# EAGLE design AVR-Doper (EAGLE 4.16)
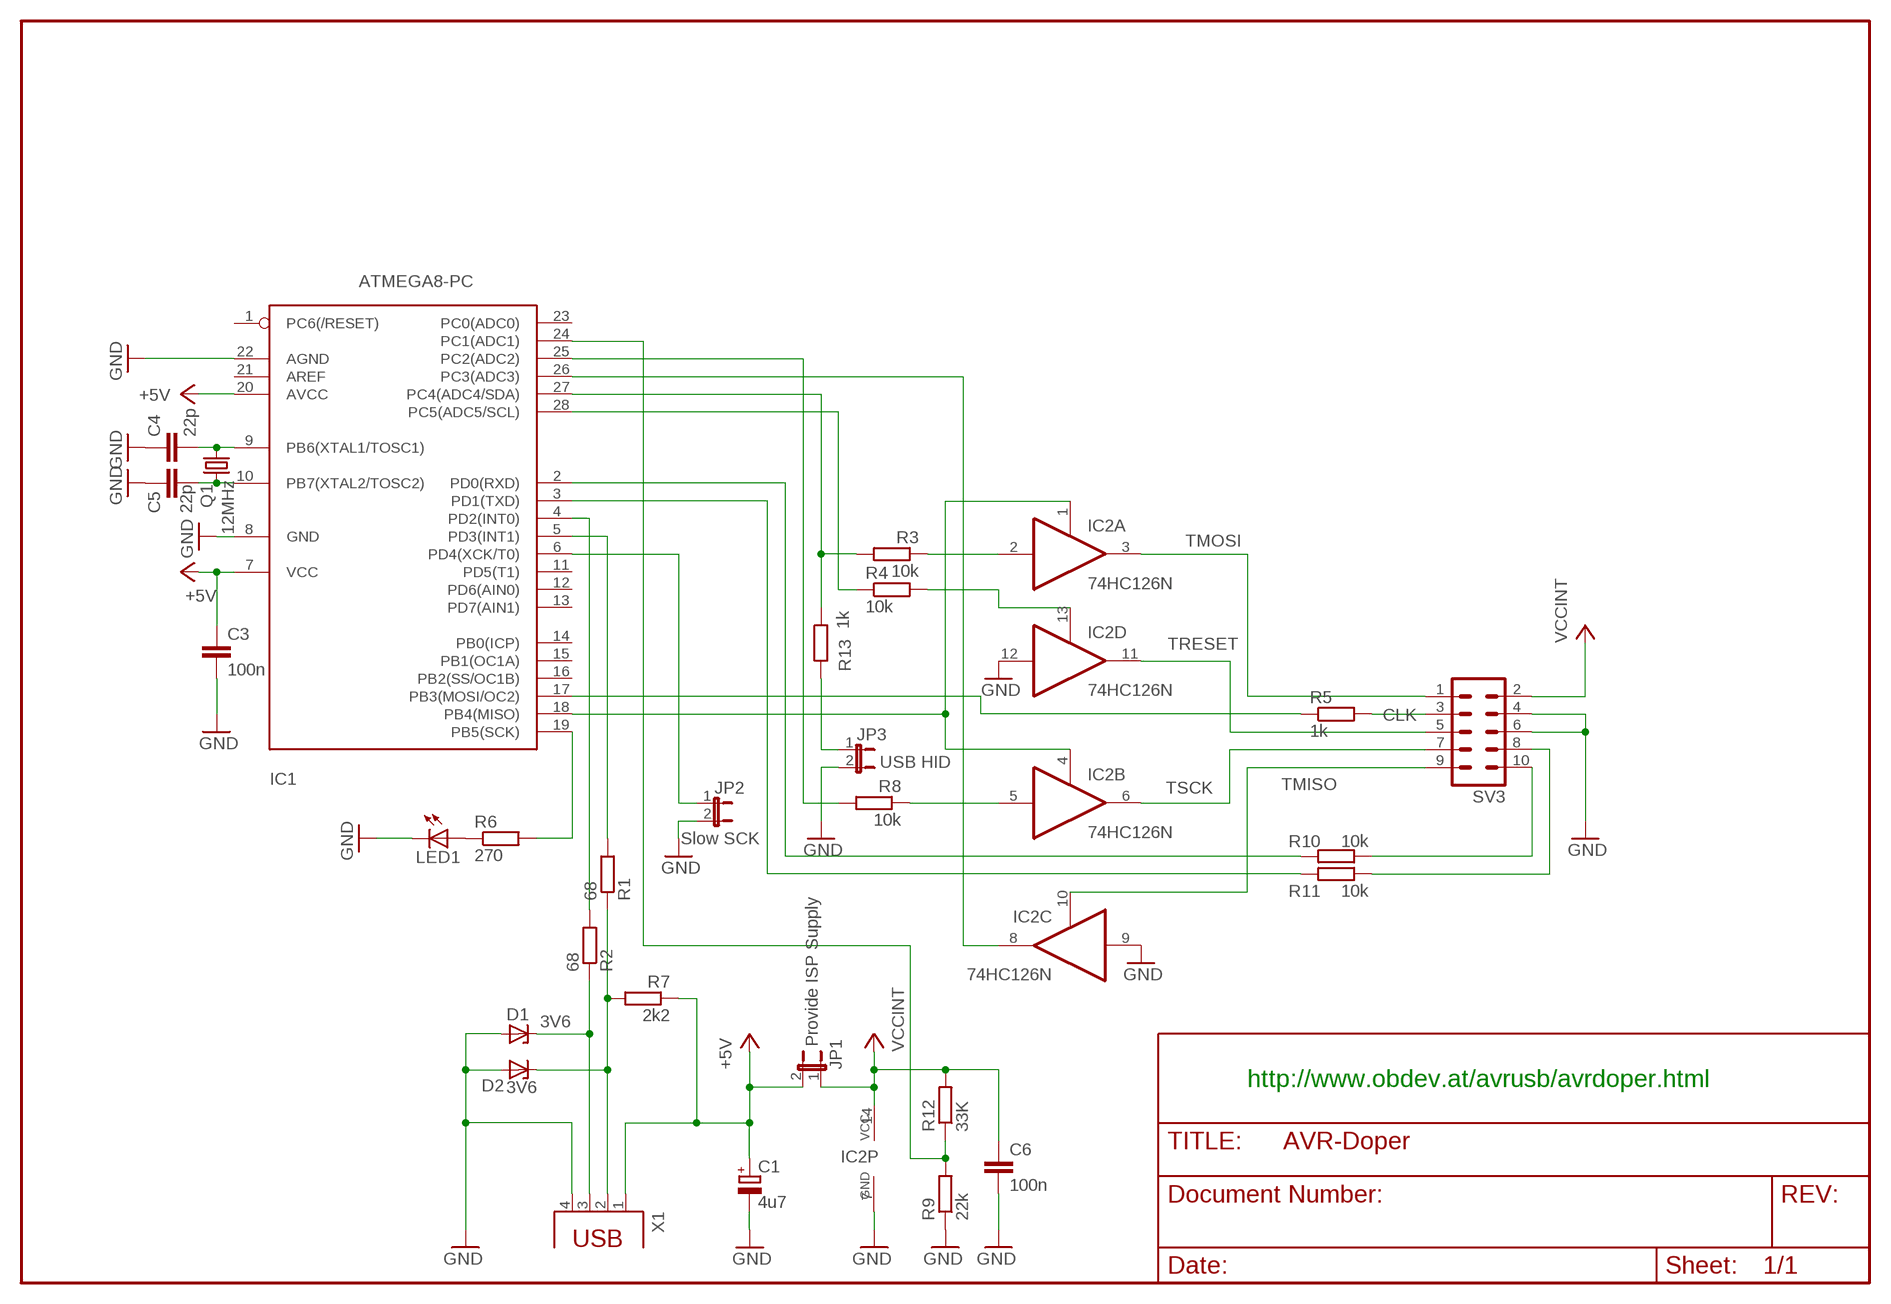
[diagram p0: schematic, sheet 1]

## Parts
C1  4u7  CPOL-EUE2.5-5  [E2,5-5]
C3  100n  C-EU025-024X044  [C025-024X044]
C4  22p  C-EU025-024X044  [C025-024X044]
C5  22p  C-EU025-024X044  [C025-024X044]
C6  100n  C-EU025-024X044  [C025-024X044]
D1  3V6  ZENER-DIODEDO34-7  [DO34Z7]
D2  3V6  ZENER-DIODEDO34-7  [DO34Z7]
IC1  ATMEGA8-PC  MEGA8-P  [DIL28-3]
IC2  74HC126N  [DIL14]
JP1  Provide ISP Supply  JP1E  [JP1]
JP2  Slow SCK  JP1E  [JP1]
JP3  USB HID  JP1E  [JP1]
LED1  LED3MM  [LED3MM]
Q1  12MHz  CRYTALHC49S  [HC49/S]
R1  68  R-EU_0207/10  [0207/10]
R2  68  R-EU_0207/10  [0207/10]
R3  10k  R-EU_0207/10  [0207/10]
R4  10k  R-EU_0207/15  [0207/15]
R5  1k  R-EU_0207/15  [0207/15]
R6  270  R-EU_0207/12  [0207/12]
R7  2k2  R-EU_0207/10  [0207/10]
R8  10k  R-EU_0207/10  [0207/10]
R9  22k  R-EU_0207/15  [0207/15]
R10  10k  R-EU_0207/10  [0207/10]
R11  10k  R-EU_0207/10  [0207/10]
R12  33K  R-EU_0207/12  [0207/12]
R13  1k  R-EU_0207/10  [0207/10]
SV3  ML10  [ML10]
X1  PN61729  [PN61729]

## Nets
+5V: C1.+ C3.1 IC1.7(VCC) IC1.20(AVCC) JP1.2 R7.1 X1.1
CLK: R5.2 SV3.3
GND: C1.- C3.2 C4.1 C5.1 C6.2 D1.A D2.A IC1.8(GND) IC1.22(AGND) IC2.7(P:GND) IC2.9(C:I) IC2.12(D:I) JP2.2 JP3.2 LED1.K(C) R9.1 SV3.4 SV3.6 X1.4
N$1: IC1.18(PB4(MISO)) IC2.1(A:OE) IC2.4(B:OE)
N$2: IC2.2(A:I) R3.1
N$3: IC2.5(B:I) R8.1
N$4: IC1.27(PC4(ADC4/SDA)) R3.2 R13.1
N$5: D2.C R1.1 R7.2 X1.2
N$6: IC1.25(PC2(ADC2)) R8.2
N$7: IC1.4(PD2(INT0)) R2.2
N$8: D1.C R2.1 X1.3
N$9: IC1.28(PC5(ADC5/SCL)) R4.1
N$10: IC1.26(PC3(ADC3)) IC2.8(C:O)
N$11: IC1.24(PC1(ADC1)) R9.2 R12.1
N$12: R10.1 SV3.10
N$13: IC1.2(PD0(RXD)) R10.2
N$14: IC1.3(PD1(TXD)) R11.2
N$15: R11.1 SV3.8
N$16: LED1.A R6.1
N$20: IC2.13(D:OE) R4.2
N$21: IC1.5(PD3(INT1)) R1.2
N$22: C4.2 IC1.9(PB6(XTAL1/TOSC1)) Q1.2
N$23: C5.2 IC1.10(PB7(XTAL2/TOSC2)) Q1.1
N$32: JP3.1 R13.2
N$38: IC1.6(PD4(XCK/T0)) JP2.1
N$39: IC1.19(PB5(SCK)) R6.2
SCI: IC1.17(PB3(MOSI/OC2)) R5.1
TMISO: IC2.10(C:OE) SV3.9
TMOSI: IC2.3(A:O) SV3.1
TRESET: IC2.11(D:O) SV3.5
TSCK: IC2.6(B:O) SV3.7
VCCINT: C6.1 IC2.14(P:VCC) JP1.1 R12.2 SV3.2
Unconnected: IC1.1(PC6(/RESET)) IC1.11(PD5(T1)) IC1.12(PD6(AIN0)) IC1.13(PD7(AIN1)) IC1.14(PB0(ICP)) IC1.15(PB1(OC1A)) IC1.16(PB2(SS/OC1B)) IC1.21(AREF) IC1.23(PC0(ADC0))

## Notes on the sheet
- http://www.obdev.at/avrusb/avrdoper.html

## Library data of the parts
C1 = rcl:CPOL-EU: POLARIZED CAPACITOR, European symbol
C3-C6 = rcl:C-EU: CAPACITOR, European symbol
D1 D2 = diode:ZENER-DIODE: Z-Diode
IC1 = atmel:MEGA8-P: MICROCONTROLLER 8 Kbytes FLASH 1 kbytes SRAM 512 bytes EEPROM USART 4-channel 10 bit ADC 2-channel 8 bit ADC Source: avr.lbr
IC2 = 74xx-eu:74*126: Quad bus BUFFER, 3-state
JP1-JP3 = jumper:JP1E: JUMPER
LED1 = led:LED: LED OSRAM: - CHIPLED LG R971, LG N971, LY N971, LG Q971, LY Q971, LO R971, LY R971 LH N974, LH R974 LS Q976, LO Q976, LY Q976 LO Q996 - Hyper CHIPLED LW Q18S LB Q993, LB Q99A, LB R99A - SideLED LS A670, LO A670, LY A670, LG A670, LP A670 LB A673, LV A673, LT A673, LW A673 LH A674 LY A675 LS A676, LA A676, LO A676, LY A676, LW A676 LS A679, LY A679, LG A679 - Hyper Micro SIDELED® LS Y876, LA Y876, LO Y876, LY Y876 LT Y87S - SmartLED LW L88C, LW L88S LB L89C, LB L89S, LG L890 LS L89K, LO L89K, LY L89K LS L896, LA L896, LO L896, LY L896 - TOPLED LS T670, LO T670, LY T670, LG T670, LP T670 LSG T670, LSP T670, LSY T670, LOP T670, LYG T670 LG T671, LOG T671, LSG T671 LB T673, LV T673, LT T673, LW T673 LH T674 LS T676, LA T676, LO T676, LY T676, LB T676, LH T676, LSB T676, LW T676 LB T67C, LV T67C, LT T67C, LS T67K, LO T67K, LY T67K, LW E67C LS E67B, LA E67B, LO E67B, LY E67B, LB E67C, LV E67C, LT E67C LW T67C LS T679, LY T679, LG T679 LS T770, LO T770, LY T770, LG T770, LP T770 LB T773, LV T773, LT T773, LW T773 LH T774 LS E675, LA E675, LY E675, LS T675 LS T776, LA T776, LO T776, LY T776, LB T776 LHGB T686 LT T68C, LB T68C - Hyper Mini TOPLED® LB M676 - Mini TOPLED Santana® LG M470 LS M47K, LO M47K, LY M47K Source: http://www.osram.convergy.de/
Q1 = crystal:CRYTAL: CRYSTAL
R1-R13 = rcl:R-EU_: RESISTOR, European symbol
SV3 = con-harting-ml:ML10: HARTING
X1 = con-berg:PN61729: BERG USB connector

## Board
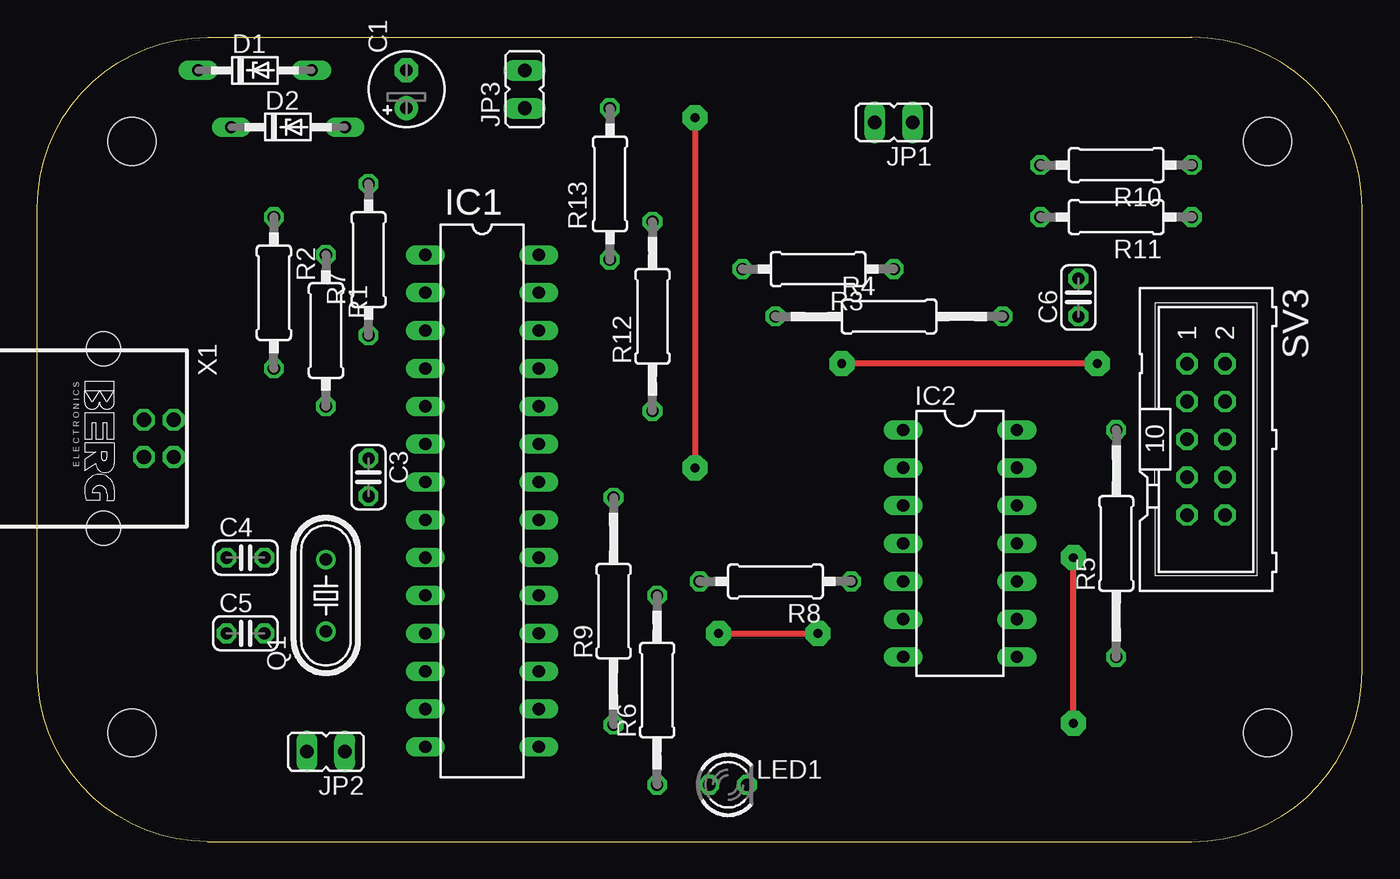
[diagram p1: board, top side]
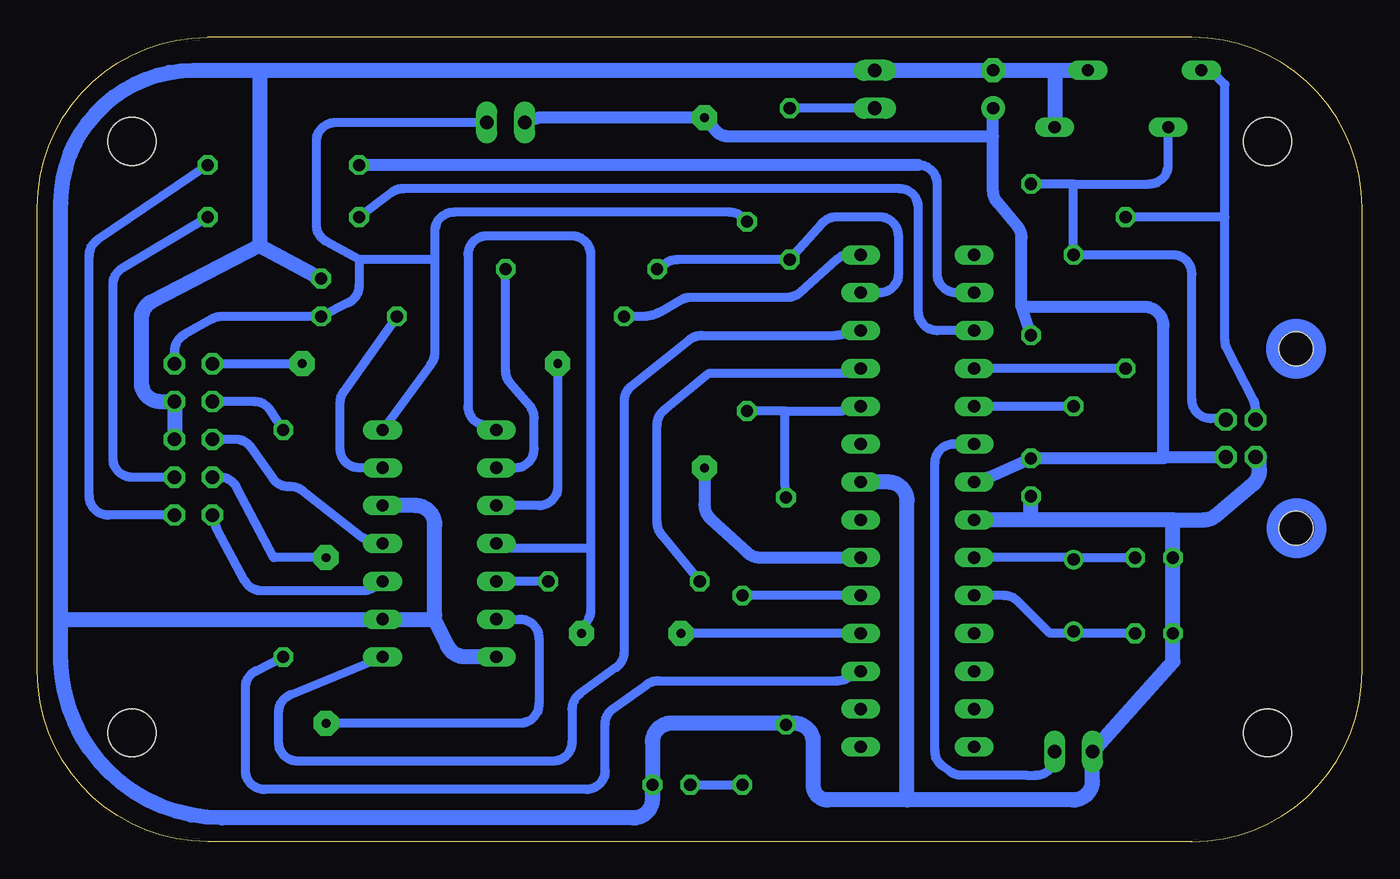
[diagram p2: board, bottom side, seen from below]

Size 88.9 x 53.98 mm. Coordinates in mm from the lower left corner, seen from the top.
Outline: 0,11.43 0,42.55 arc-90 11.43,53.98 77.47,53.98 arc-90 88.9,42.55 88.9,11.43 arc-90 77.47,0 11.43,0 arc-90 0,11.43
Copper layers (1*16): Top 0.035mm / dielectric 1.5mm / Bottom 0.035mm
Design rules "default": minimum track width 10mil, minimum drill 24mil, track to track 8mil, track to pad 8mil, pad to pad 8mil, via to via 8mil, smd to smd 8mil, copper to edge 40mil, drill to drill 8mil, minimum pad ring 10mil, minimum via ring 8mil, stop-mask expansion 4mil, vias tented up to drill 0mil, thermal gap 10mil
Holes 3.2 mm at 6.35,7.3 6.35,46.99 82.55,7.3 82.55,46.99
bRestrict: area 0,41.3 to 11.4,54; area 76.2,42.9 to 88.9,54.3; area 77.5,0 to 88.9,12.7; area 0,0 to 12.7,11.4

### Footprints (pad centres in the part's own frame; a part is rotated, then mirrored left to right if it is on the bottom)
E2,5-5 = drill 0.813 pad 1.6 round: + -1.27,0 | drill 0.813 pad 1.6 octagon: - 1.27,0
C025-024X044 = drill 0.813 octagon: 1 -1.27,0; 2 1.27,0
DO34Z7 = drill 0.813 long: A 3.81,0; C -3.81,0
DIL28-3 = drill 0.813 long: 1 -16.51,-3.81; 2 -13.97,-3.81; 3 -11.43,-3.81; 4 -8.89,-3.81; 5 -6.35,-3.81; 6 -3.81,-3.81; 7 -1.27,-3.81; 8 1.27,-3.81; 9 3.81,-3.81; 10 6.35,-3.81; 11 8.89,-3.81; 12 11.43,-3.81; 13 13.97,-3.81; 14 16.51,-3.81; 15 16.51,3.81; 16 13.97,3.81; 17 11.43,3.81; 18 8.89,3.81; 19 6.35,3.81; 20 3.81,3.81; 21 1.27,3.81; 22 -1.27,3.81; 23 -3.81,3.81; 24 -6.35,3.81; 25 -8.89,3.81; 26 -11.43,3.81; 27 -13.97,3.81; 28 -16.51,3.81
DIL14 = drill 0.813 long: 1 -7.62,-3.81; 2 -5.08,-3.81; 3 -2.54,-3.81; 4 0,-3.81; 5 2.54,-3.81; 6 5.08,-3.81; 7 7.62,-3.81; 8 7.62,3.81; 9 5.08,3.81; 10 2.54,3.81; 11 0,3.81; 12 -2.54,3.81; 13 -5.08,3.81; 14 -7.62,3.81
JP1 = drill 0.914 long: 1 0,-1.27; 2 0,1.27
LED3MM = drill 0.813 octagon: A -1.27,0; K 1.27,0
HC49/S = drill 0.813 round: 1 -2.413,0; 2 2.413,0
0207/10 = drill 0.813 octagon: 1 -5.08,0; 2 5.08,0
0207/15 = drill 0.813 octagon: 1 -7.62,0; 2 7.62,0
0207/12 = drill 0.813 octagon: 1 -6.35,0; 2 6.35,0
ML10 = drill 0.914 octagon: 1 -5.08,-1.27; 2 -5.08,1.27; 3 -2.54,-1.27; 4 -2.54,1.27; 5 0,-1.27; 6 0,1.27; 7 2.54,-1.27; 8 2.54,1.27; 9 5.08,-1.27; 10 5.08,1.27
PN61729 = drill 0.95 octagon: 1 1.25,4.71; 2 -1.25,4.71; 3 -1.25,2.71; 4 1.25,2.71 | hole 2.3: -6.02,0; 6.02,0

### Placement (x,y rotation side)
C1  24.77,50.48 90 top
C3  22.23,24.45 270 top
C4  13.97,19.05 0 top
C5  13.97,13.97 0 top
C6  69.85,36.51 90 top
D1  14.61,51.75 0 top
D2  16.83,47.94 0 top
IC1  29.84,22.86 270 top
IC2  61.91,20 270 top
JP1  57.47,48.26 90 top
JP2  19.37,6.03 90 top
JP3  32.7,50.48 0 top
LED1  46.35,3.81 0 top
Q1  19.37,16.51 90 top
R1  19.37,34.29 270 top
R2  15.88,36.83 270 top
R3  52.39,38.42 180 top
R4  57.15,35.24 0 top
R5  72.39,20 90 top
R6  41.59,10.16 90 top
R7  22.23,39.05 90 top
R8  49.53,17.46 180 top
R9  38.67,15.46 90 top
R10  72.39,45.4 180 top
R11  72.39,41.91 180 top
R12  41.27,35.24 90 top
R13  38.42,44.13 90 top
SV3  78.42,26.99 270 top
X1  4.45,27.05 270 top

### Tracks (layer width: path | path; a pad name or v marks a point on that pad's centre or on a via)
+5V  (via drill 0.6 pad 1.68)
  Top 0.406: v44.13,48.58 v44.13,25.08
  Bottom 0.406: X1.1 9.24,25.78 | 13.34,25.78 13.34,25.72
  Bottom 0.61: IC1.7 25.08,24.45
  Bottom 0.813: 22.86,35.88 R7.1 | 22.86,35.88 22.86,40.5 arc-40 23.15,41.31 24.45,42.86 arc45 24.77,43.63 24.77,47.31 | 9.24,25.78 13.34,25.78 | 22.86,35.88 14.61,35.88 arc90 13.34,34.61 13.34,25.72 C3.1 25.08,24.45 | v44.13,25.08 44.13,22.59 arc-47 43.72,21.66 41.26,19.39 arc-43 40.4,19.05 IC1.20 | JP1.2 55.24,48.58 v44.13,48.58 43.55,47.92 arc-59 42.46,47.31 24.77,47.31 | 24.77,47.31 C1.+
CLK
  Bottom 0.305: SV3.3 76.2,29.53
  Bottom 0.61: R5.2 73.28,28.96 arc-56 74.34,29.53 SV3.3
GND
  Bottom 0.406: 58.42,12.38 IC2.7 | 62.26,14.92 62.23,15.24
  Bottom 1.016: 20.64,51.75 D2.A | 20.64,51.75 D1.A | 12.7,21.59 C4.1 C5.1 12.7,12.06 JP2.2 18.11,4.14 18.11,4.05 arc91 19.38,2.79 30.54,2.79 | 12.7,21.59 22.23,21.59 | 22.23,21.59 IC1.8 | 22.23,21.59 C3.2 | SV3.6 SV3.4 80.64,29.53 arc90 81.92,30.8 81.92,35.11 arc63 81.23,36.23 73.98,40.01 | 7.21,25.8 X1.4 6.9,25.8 6.9,25.83 6.89,24.94 arc50 7.34,23.97 9.8,21.89 arc40 10.62,21.59 12.7,21.59 | 38.73,7.94 38.99,7.94 38.99,7.91 R9.1 | 47.62,3.17 47.62,6.67 arc90 46.35,7.94 38.42,7.94 | 73.98,40.01 73.98,51.75 74.3,51.75 | 12.7,21.59 13.34,21.59 | 30.54,2.79 35.88,2.79 arc90 36.83,3.75 36.83,6.67 arc-90 38.1,7.94 38.42,7.94 | 58.42,12.38 58.42,12.41 60.23,12.41 arc64 61.37,13.12 62.26,14.92 IC2.9 87.31,14.92 | 62.23,15.24 62.23,21.27 arc-90 63.5,22.54 IC2.12 | 73.98,40.01 C6.2 | 20.64,51.75 C1.- JP3.2 74.3,51.75 | 30.54,2.79 30.54,22.86 arc-90 31.81,24.13 IC1.22 | 47.62,3.17 47.62,2.86 arc90 48.9,1.59 76.52,1.59 arc88 87.31,12.06 arc3 87.31,14.92 | 47.62,3.17 LED1.K | 74.3,51.75 78.42,51.75 arc-90 87.31,42.86 87.31,14.92 | 38.73,7.94 arc90 38.67,7.87 R9.1 | 38.42,7.94 38.73,7.94 | 38.42,7.94 38.58,7.94 arc-90 R9.1
N$1  (via drill 0.6 pad 1.68)
  Top 0.406: v45.72,13.97 v52.39,13.97
  Bottom 0.305: IC2.4 58.74,20
  Bottom 0.406: 58.1,19.68 IC2.4
  Bottom 0.61: IC1.18 v45.72,13.97 | IC2.1 58.42,27.94 58.74,27.94 arc90 60.01,29.21 60.01,39.37 arc90 58.74,40.64 53.02,40.64 arc90 51.75,39.37 51.75,19.68 | 51.75,19.68 58.1,19.68 | v52.39,13.97 51.89,14.97 arc-27 51.75,15.54 51.75,19.68
N$2
  Bottom 0.61: IC2.2 56.83,25.08 arc-90 55.56,26.35 55.56,28.42 arc-41 55.87,29.25 57.16,30.76 arc41 57.47,31.59 R3.1
N$3
  Bottom 0.61: R8.1 IC2.5
N$4
  Bottom 0.61: IC1.27 32.38,36.83 arc-90 31.11,38.1 31.11,40.64 arc-90 32.38,41.91 35.31,41.91 arc-48 36.26,41.48 R13.1 45.97,39.05 arc-34 46.67,38.84 R3.2
N$5
  Bottom 0.406: X1.2 9.21,28.38
  Bottom 0.61: 19.37,44.13 R1.1 12.7,39.37 arc90 11.43,38.1 11.43,29.65 arc-90 10.16,28.38 9.21,28.38 | 19.37,44.13 R7.2 | 19.37,44.13 14.29,44.13 arc-90 13.02,45.4 D2.C
N$6
  Bottom 0.61: IC1.25 34.02,31.57 arc27 34.59,31.43 43.81,31.43 46.84,28.96 arc-51 47.31,27.97 47.31,21.41 arc-39 47.02,20.6 R8.2
N$7
  Bottom 0.61: R2.2 IC1.4
N$8
  Bottom 0.406: 10.16,51.75 D1.C
  Bottom 0.61: X1.3 7.17,29.11 arc-26 7.31,29.66 9.07,33.06 arc27 9.21,33.65 9.21,41.91 | 9.21,41.91 R2.1 | 9.21,41.91 9.21,50.8 10.16,51.75
N$9
  Bottom 0.61: IC1.28 34.44,39.37 arc-42 35.29,39.04 37.74,36.84 arc42 38.59,36.51 45.06,36.51 arc-30 45.7,36.34 47.09,35.55 arc30 48.24,35.24 R4.1
N$10
  Bottom 0.61: IC1.26 35.12,34 arc11 35.37,33.97 44.32,33.97 arc-39 45.12,33.69 49.05,30.54 arc-51 49.53,29.55 49.53,12.71 arc54 50.05,11.69 52.5,9.9 arc-54 53.02,8.88 53.02,6.67 arc90 54.29,5.4 71.44,5.4 arc90 72.71,6.67 72.71,8.67 arc68 71.92,9.85 IC2.8
N$11
  Bottom 0.61: 38.73,28.89 34.92,28.89 IC1.24 | 38.73,28.89 R12.1 | R9.2 38.73,24.13 38.73,28.89
N$12
  Bottom 0.61: SV3.10 84.14,21.91 arc90 85.41,23.18 85.41,39.33 arc56 84.85,40.38 R10.1
N$13
  Bottom 0.61: IC1.2 27.24,36.83 arc90 28.51,38.1 28.51,44.13 arc-90 29.78,45.4
  Bottom 0.813: 29.78,45.4 R10.2
N$14
  Bottom 0.61: IC1.3 28.51,34.29 arc90 29.78,35.56 29.78,42.55 arc-90 31.05,43.81 64.35,43.81 arc-37 65.11,43.56 R11.2
N$15
  Bottom 0.61: SV3.8 82.55,24.45 arc90 83.82,25.72 83.82,37.38 arc59 83.2,38.47 R11.1
N$16
  Bottom 0.61: LED1.A R6.1
N$20
  Bottom 0.61: IC2.13 67.31,25.08 arc90 68.58,26.35 68.58,29.44 arc35 68.35,30.17 R4.2
N$21
  Bottom 0.61: R1.2 IC1.5
N$22
  Bottom 0.61: IC1.9 19.49,19.05 Q1.2 19.24,19.05 C4.2
N$23
  Bottom 0.406: 20.95,13.97 Q1.1
  Bottom 0.61: IC1.10 24.02,16.51 arc45 23.12,16.14 20.95,13.97 C5.2
N$32
  Bottom 0.61: JP3.1 R13.2
N$38
  Bottom 0.61: IC1.6 27.39,26.69 arc-91 28.67,25.42 28.67,6.08 arc-54 28.14,5.05 27.64,4.68 arc-36 26.89,4.45 22.54,4.45 | 22.54,4.45 arc-90 22.54,4.45 | 22.54,4.45 21.91,4.45 arc-90 20.64,5.71 JP2.1
N$39
  Bottom 0.406: 41.91,16.51 R6.2
  Bottom 0.61: IC1.19 R6.2
SCI
  Bottom 0.61: R5.1 74.23,11.46 arc-63 74.93,10.33 74.93,4.76 arc-90 73.66,3.49 52.07,3.49 arc-90 50.8,4.76 50.8,7.88 arc55 50.27,8.92 47.95,10.56 arc35 47.22,10.79 35.23,10.79 arc-27 34.66,10.93 IC1.17
TMISO
  Bottom 0.61: IC2.10 66.36,17.04 arc34 67.06,16.83 73.85,16.83 arc62 74.97,17.5 76.83,20.95 SV3.9
TMOSI  (via drill 0.6 pad 1.68)
  Top 0.406: v71.12,32.07 v53.98,32.07
  Bottom 0.61: SV3.1 v71.12,32.07 | v53.98,32.07 53.98,23.81 arc90 55.24,22.54 IC2.3
TRESET
  Bottom 0.61: IC2.11 66.73,20.25 arc24 67.21,20.49 71.09,23.54 arc-38 71.88,23.81 72.05,23.81 arc55 73.09,24.35 74.55,26.45 arc-55 75.59,26.99 SV3.5
TSCK  (via drill 0.6 pad 1.68)
  Top 0.406: v69.53,7.94 v69.53,19.05
  Bottom 0.61: SV3.7 76.65,24.45 arc62 75.53,23.77 73.03,19.05 v69.53,19.05 | IC2.6 56.52,14.92 arc90 55.24,13.65 55.24,9.21 arc90 56.52,7.94 v69.53,7.94
VCCINT
  Bottom 0.61: 62.23,39.05 62.23,40.96 arc90 60.96,42.23 42.44,42.23 arc45 41.54,41.85 R12.2 | 62.23,39.05 62.23,32.8 arc36 62.48,32.05 IC2.14 | SV3.2 79.69,32.91 arc61 79.04,34.02 77.12,35.08 arc29 76.51,35.24 C6.1 68.01,36.16 arc-63 67.31,37.3 67.31,39.05 | 67.31,39.05 69.51,40.28 arc61 70.17,41.39 70.17,46.99 arc90 68.9,48.26 JP1.1 | 62.23,39.05 67.31,39.05
(copper drawn outside any net)
  shapes: Bottom circle x2